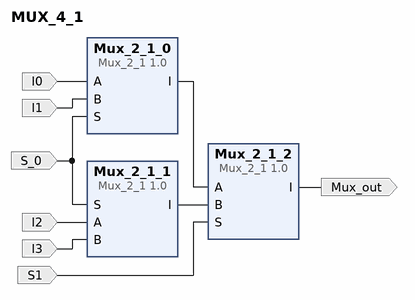
[diagram p0: block diagram of the top level]
# Vivado block design MUX_4_1, xc7z010clg400-1, Vivado 2019.1
create_bd_design MUX_4_1

create_bd_port -dir I S1
create_bd_port -dir I S_0
create_bd_port -dir I I0
create_bd_port -dir I I1
create_bd_port -dir I I2
create_bd_port -dir I I3
create_bd_port -dir O Mux_out

create_bd_cell -type ip -vlnv xilinx.com:user:Mux_2_1:1.0 Mux_2_1_0
create_bd_cell -type ip -vlnv xilinx.com:user:Mux_2_1:1.0 Mux_2_1_1
create_bd_cell -type ip -vlnv xilinx.com:user:Mux_2_1:1.0 Mux_2_1_2

# ---- connections ----

connect_bd_net [get_bd_pins Mux_2_1_0/I] [get_bd_pins Mux_2_1_2/A]
connect_bd_net [get_bd_pins Mux_2_1_1/I] [get_bd_pins Mux_2_1_2/B]
connect_bd_net -net S_0_1 [get_bd_ports S1] [get_bd_pins Mux_2_1_2/S]
connect_bd_net -net S_0_2 [get_bd_ports S_0] [get_bd_pins Mux_2_1_0/S] [get_bd_pins Mux_2_1_1/S]
connect_bd_net -net I0_1 [get_bd_ports I0] [get_bd_pins Mux_2_1_0/A]
connect_bd_net -net I1_1 [get_bd_ports I1] [get_bd_pins Mux_2_1_0/B]
connect_bd_net -net I2_1 [get_bd_ports I2] [get_bd_pins Mux_2_1_1/A]
connect_bd_net -net I3_1 [get_bd_ports I3] [get_bd_pins Mux_2_1_1/B]
connect_bd_net [get_bd_pins Mux_2_1_2/I] [get_bd_ports Mux_out]

validate_bd_design
save_bd_design
